# Altium schematic sheet Communication.SchDoc
size A4; Organization: Rotronic AG; Address1: Grindelstrasse 6; Address2: 8303 Bassersdorf; Address3: Switzerland; DocumentNumber: 6; SheetNumber: 6; SheetTotal: 10; Web_Address: www.rotronic.ch; E_Mail_Address: *@rotronic.ch; Fon: +41 (0)44 838 11 11; Fax: +41 (0)44 836 44 24
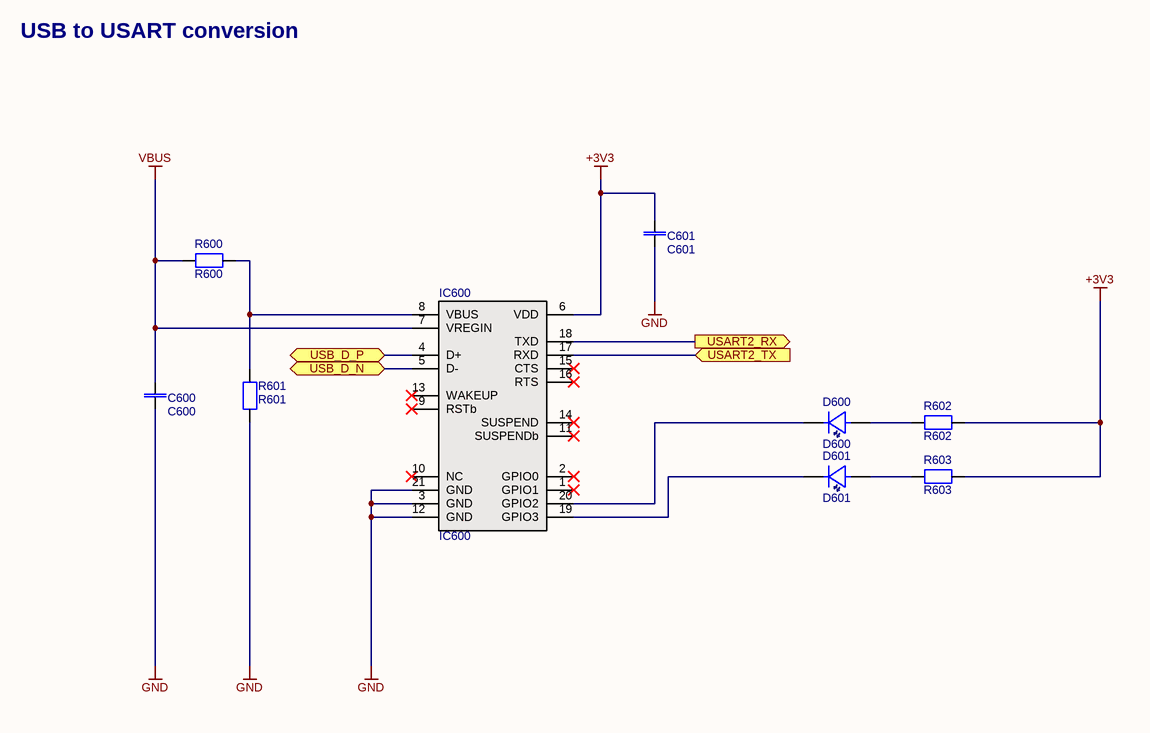
[diagram p0: Communication.SchDoc]

## Parts
C600  C600  [0805-2012]
C601  C601  [0805-2012]
D600  D600  [0805_LED]
D601  D601  [0805_LED]
IC600  IC600  [GQFN20R]
R600  R600  [0603-1608]
R601  R601  [0603-1608]
R602  R602  [0805-2012]
R603  R603  [0805-2012]

## Ports
USART2_RX (out), USART2_TX (in), USB_D_N (bidir), USB_D_P (bidir)

## Nets
+3V3: C601.1 IC600.6(VDD) R602.2 R603.2
GND: C600.2 C601.2 IC600.3(GND) IC600.12(GND) IC600.21(GND) R601.2
VBUS: C600.1 IC600.7(VREGIN) R600.1
USART2_RX: IC600.18(TXD) ; port USART2_RX
USART2_TX: IC600.17(RXD) ; port USART2_TX
USB_D_N: IC600.5(D-) ; port USB_D_N
USB_D_P: IC600.4(D+) ; port USB_D_P
NetD600_1: D600.1(A) R602.1
NetD600_2: D600.2(K) IC600.20(GPIO2)
NetD601_1: D601.1(A) R603.1
NetD601_2: D601.2(K) IC600.19(GPIO3)
NetIC600_8: IC600.8(VBUS) R600.2 R601.1

Not connected (* = marked no-connect by the designer): IC600 1(GPIO1)* 2(GPIO0)* 9(RSTb)* 10(NC)* 11(SUSPENDb)* 13(WAKEUP)* 14(SUSPEND)* 15(CTS)* 16(RTS)*

## Notes on the sheet
- USB to USART conversion
- Byte Overflow - DIY Electronics projects
- _byteoverflow_
- Revision
- AD-Version
- Designer
- Datum
- elektronisch signiert
- Sheet
- of

## Library data of the parts
C600 C601 = F0127: Capacitor; Part-Number: 63.0105.1500; Manufacturer: Murata Electronics North America; Manufacturer Part Number: GRM21BF51H105ZA12L; Designator: C 1uF 50V; ID: F0127; Operating Range: -30°C to +85°C; Note: 1uF 50V Y5V 20% Murata GRM21BF51H105ZA12L; Specification: 27.12.2012 OPT; Value: 1uF 50V; Component Type: Standard; ComponentLink1Description: Datasheet; ComponentLink1URL: http://www.murata.com/products/catalog/pdf/c02e.pdf; Status: Active; Availability Date: 15.11.2016 OPT; RoHS compliant: Yes; Flammability: n.a.; ComponentLink2Description: http://search.murata.co.jp/Ceramy/image/img/A01X/G101/ENG/GRM21BF51H105ZA12-01.pdf; ComponentLink2URL: http://search.murata.co.jp/Ceramy/image/img/A01X/G101/ENG/GRM21BF51H105ZA12-01.pdf; Pin Count: 2; Price 100: 0.067; Price 1000: 0.067; Price Date: 02.12.2019 Pro Alpha; Changed: 27.12.2012 OPT; Price: 0.118; Supplier 1: Digi-Key; Supplier Part Number 1: 490-3903-1-ND; Part Status: Discontinued at Digi-Key; RoHS: RoHS Compliant
D600 D601 = A0053: LED; Part-Number: 00.0000.0000; Manufacturer: Dialight; Manufacturer Part Number: 5988170107F; Designator: LED SMD 0805; ID: A0053; Operating Range: -30°C to +85°C; Note: LED SMD 0805 Green Dialight 598-8170-107F; Value: LED SMD 0805; Specification: 27.12.2012 OPT; Verification: 25.01.2013 MLP; Component Type: Standard; ComponentLink1Description: Datasheet; ComponentLink1URL: http://www.dialight.com/Assets/Brochures_And_Catalogs/Indication/598_SelectorGuide.pdf; Status: Active; Availability Date: 14.11.2016 OPT; RoHS compliant: Yes; Flammability: n.a.; Pin Count: 2; Price 100: 0.092; Price 1000: 0.075; Changed: 27.12.2012 OPT; Price: 0.092; Price Date: 17.09.2014 OPT; Supplier: Digi-Key; Supplier Part Number: 350-2044-1-ND; Part Status: Active; RoHS: RoHS Compliant
IC600 = E0130: Interface; Part-Number: 00.0000.0000; Manufacturer: Silicon Labs; Manufacturer Part Number: CP2102N-A02-GQFN20; ID: E0130; Operating Range: -40°C to +85°C; Note: USB-IC-Schnittstelle USB to UART bridge - QFN20; Specification: 02.12.2019 PEK; Value: CP2102N-A02; Designator: CP2102N-A02; Component Type: Standard; ComponentLink1Description: Datasheet; ComponentLink1URL: https://www.mouser.ch/datasheet/2/368/cp2102n-datasheet-1634912.pdf; Status: Active; Availability Date: 02.12.2019 PEK; RoHS compliant: Yes; Flammability: n.a; Pin Count: 21; Price 100: 1.18; Price 1000: 1.14; Price Date: 02.12.2019 PEK; Changed: 02.12.2019 PEK; Price: 1.27; Supplier 1: Mouser; Supplier Part Number 1: CP2102N-A02-GQFN20; Part Status: Active; RoHS: RoHS Compliant
R600 = Q0094: Resistor; Part-Number: 71.2202.1300; Manufacturer: Vishay Dale; Manufacturer Part Number: CRCW060322K0FKEA; ID: Q0094; Operating Range: -55°C to +155°C; Note: 22k 1% 100ppm 1/10W Vishay CRCW060322K0FKTA; Changed: 19.09.2011 MLP; Value: 22k 1%; Verification: 05.07.2012 OPT; Designator: R 22k 1%; Component Type: Standard; ComponentLink1Description: http://www.vishay.com/docs/20035/dcrcwe3.pdf; ComponentLink1URL: http://www.vishay.com/docs/20035/dcrcwe3.pdf; Status: Active; Availability Date: 16.11.2016 OPT; RoHS compliant: Yes; Flammability: n.a.; Pin Count: 2; Price 100: 0.002; Price 1000: 0.002; Price Date: 02.12.2019 Pro Alpha; Specification: 19.09.2011 MLP; Price: 0.002; Part Status: Active; RoHS: RoHS Compliant; Supplier: Digi-Key; Supplier Part Number: 541-22.0KHCT-ND
R601 = Q0153: Resistor; Part-Number: 71.4702.1300; Manufacturer: Vishay Dale; Manufacturer Part Number: CRCW060347K0FKEA; ID: Q0153; Note: 47K 1% 100ppm 1/10W CRCW060347K0FKEA; Changed: 19.09.2011 MLP; Value: 47K 1%; Verification: 05.07.2012 OPT; Designator: R 47K 1%; Component Type: Standard; ComponentLink1Description: http://www.vishay.com/docs/20035/dcrcwe3.pdf; ComponentLink1URL: http://www.vishay.com/docs/20035/dcrcwe3.pdf; Operating Range: -; Status: Active; Availability Date: 16.11.2016 OPT; RoHS compliant: Yes; Flammability: n.a.; Pin Count: 2; Price 100: 0.002; Price 1000: 0.002; Price Date: 02.12.2019 Pro Alpha; Specification: 19.09.2011 MLP; Price: 0.002; Supplier: Digi-Key; Supplier Part Number: 541-47.0KHCT-ND; Part Status: Active; RoHS: RoHS Compliant
R602 R603 = Q0422: Resistor; Part-Number: 00.0000.0000; Manufacturer: Panasonic Electronic Components; Manufacturer Part Number: ERJ-6ENF5600V; Designator: R 560E 1%; ID: Q0422; Operating Range: -55°C to +155°C; Note: Dickfilmwiderstände - SMD 0805 560ohms 1% AEC-Q200; Changed: 15.11.2019 PEK; Value: 560E 1%; Component Type: Standard; ComponentLink1Description: Datasheet; ComponentLink1URL: https://www.mouser.ch/datasheet/2/315/AOA0000C304-1149620.pdf; Status: Active; Availability Date: 15.11.2019 PEK; RoHS compliant: Yes; Flammability: n.a.; Pin Count: 2; Price 100: 0.03; Price 1000: 0.011; Price Date: 15.11.2019 PEK; Specification: 15.11.2019 PEK; Price: 0.098; Supplier: Mouser; Supplier Part Number: 667-ERJ-6ENF5600V; Part Status: Active; RoHS: RoHS Compliant